# EAGLE schematic Main (EAGLE 6.0)
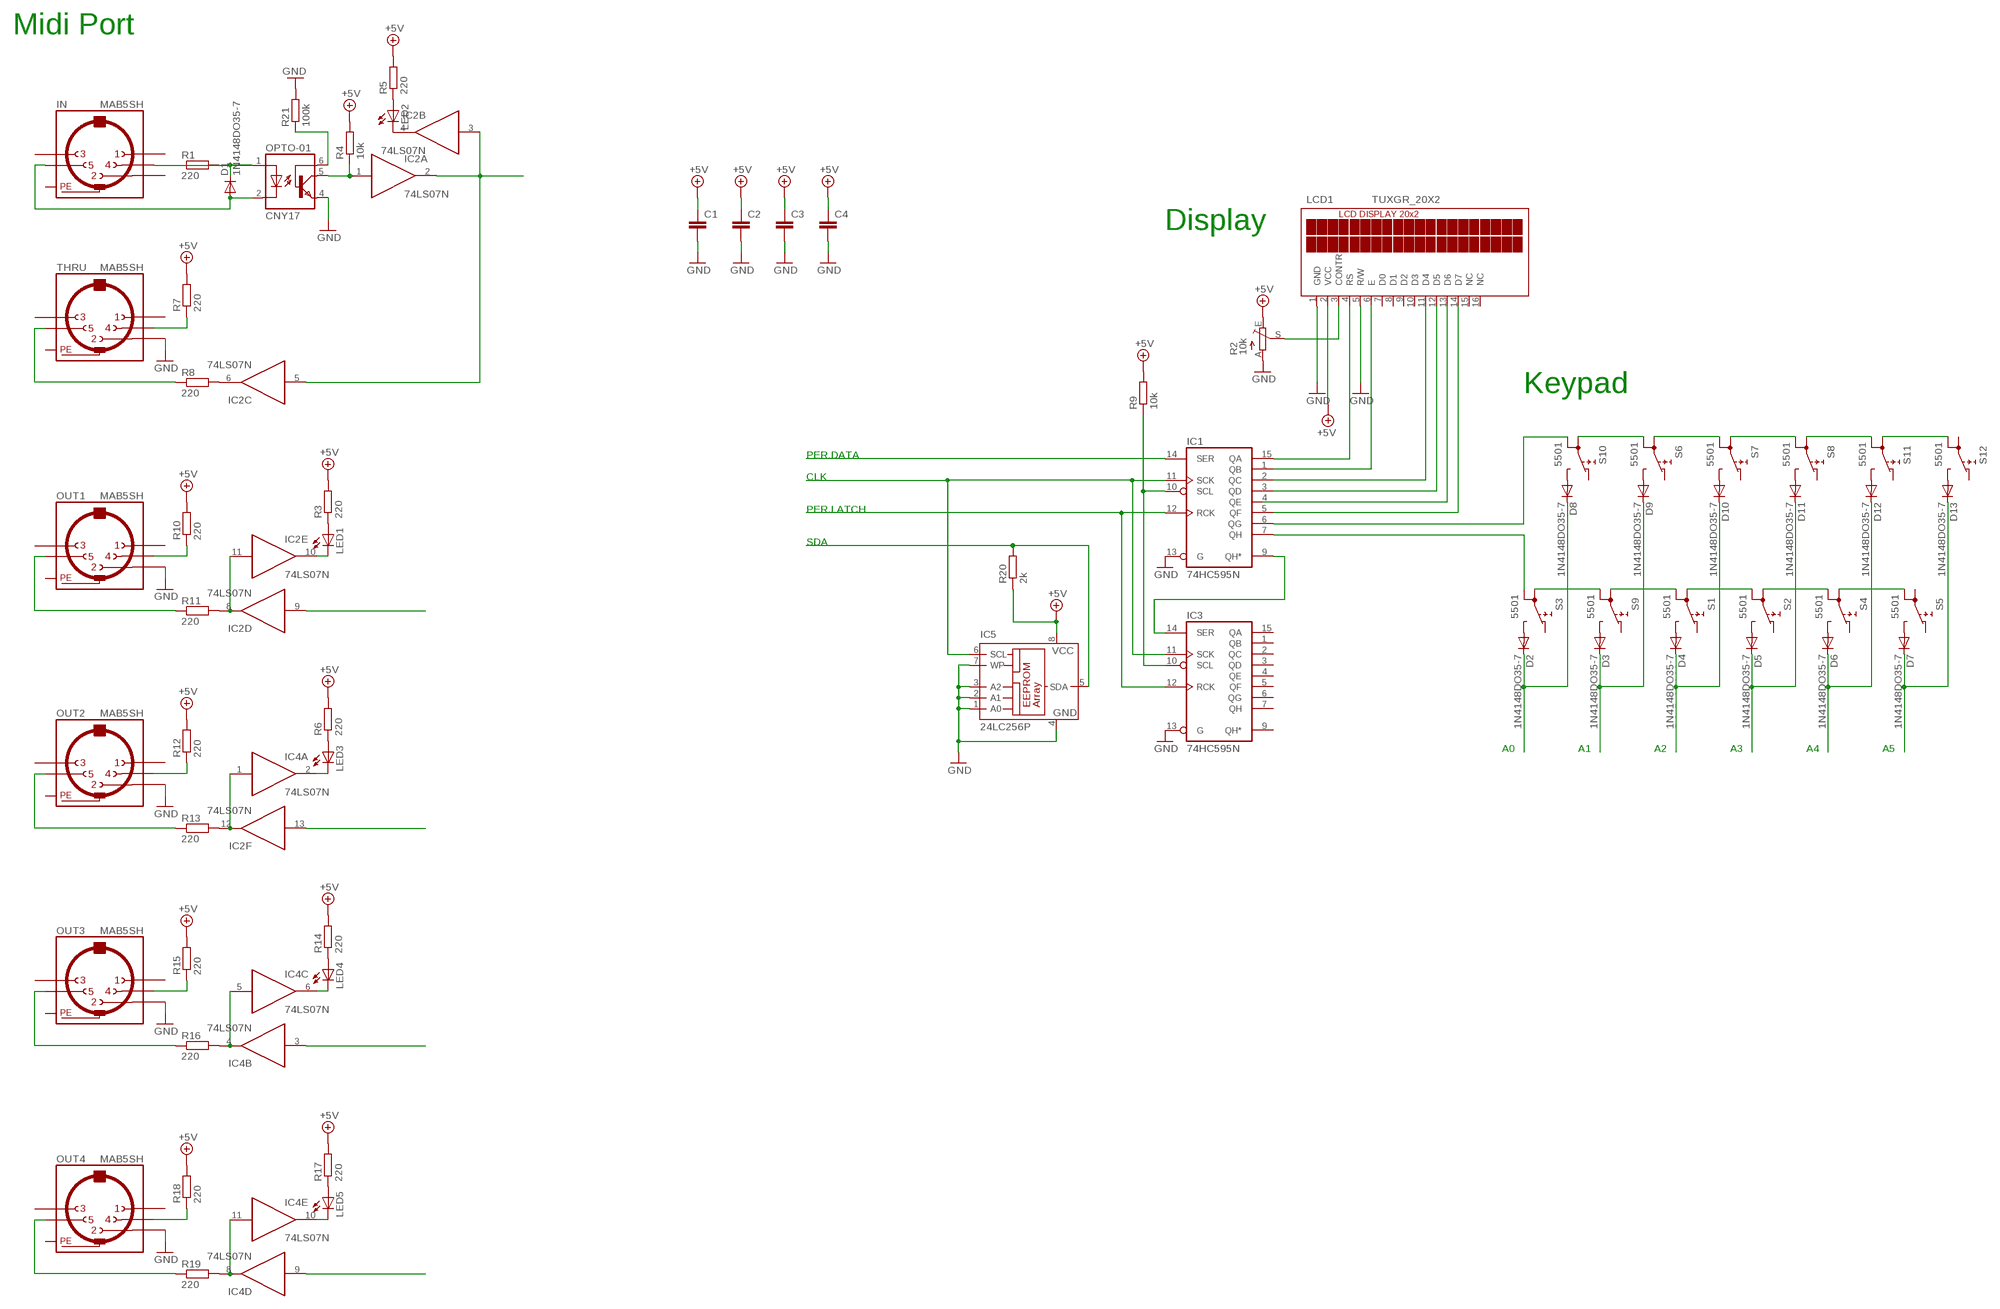
[diagram p0: schematic, sheet 1]

## Parts
C1  C-EU025-024X044  [C025-024X044]
C2  C-EU025-024X044  [C025-024X044]
C3  C-EU025-024X044  [C025-024X044]
C4  C-EU025-024X044  [C025-024X044]
D1  1N4148DO35-7  [DO35-7]
D2  1N4148DO35-7  [DO35-7]
D3  1N4148DO35-7  [DO35-7]
D4  1N4148DO35-7  [DO35-7]
D5  1N4148DO35-7  [DO35-7]
D6  1N4148DO35-7  [DO35-7]
D7  1N4148DO35-7  [DO35-7]
D8  1N4148DO35-7  [DO35-7]
D9  1N4148DO35-7  [DO35-7]
D10  1N4148DO35-7  [DO35-7]
D11  1N4148DO35-7  [DO35-7]
D12  1N4148DO35-7  [DO35-7]
D13  1N4148DO35-7  [DO35-7]
IC1  74HC595N  [DIL16]
IC2  74LS07N  [DIL14]
IC3  74HC595N  [DIL16]
IC4  74LS07N  [DIL14]
IC5  24LC256P  [DIL8]
IN  MAB5SH  [MAB5SH]
LCD1  TUXGR_20X2  [TUXGR_20X2]
LED1  LED3MM  [LED3MM]
LED2  LED3MM  [LED3MM]
LED3  LED3MM  [LED3MM]
LED4  LED3MM  [LED3MM]
LED5  LED3MM  [LED3MM]
OPTO-01  CNY17  [DIL06]
OUT1  MAB5SH  [MAB5SH]
OUT2  MAB5SH  [MAB5SH]
OUT3  MAB5SH  [MAB5SH]
OUT4  MAB5SH  [MAB5SH]
R1  220  R-EU_0207/10  [0207/10]
R2  10k  TRIM_EU-B25P  [B25P]
R3  220  R-EU_0207/10  [0207/10]
R4  10k  R-EU_0207/10  [0207/10]
R5  220  R-EU_0207/10  [0207/10]
R6  220  R-EU_0207/10  [0207/10]
R7  220  R-EU_0207/10  [0207/10]
R8  220  R-EU_0207/10  [0207/10]
R9  10k  R-EU_0207/10  [0207/10]
R10  220  R-EU_0207/10  [0207/10]
R11  220  R-EU_0207/10  [0207/10]
R12  220  R-EU_0207/10  [0207/10]
R13  220  R-EU_0207/10  [0207/10]
R14  220  R-EU_0207/10  [0207/10]
R15  220  R-EU_0207/10  [0207/10]
R16  220  R-EU_0207/10  [0207/10]
R17  220  R-EU_0207/10  [0207/10]
R18  220  R-EU_0207/10  [0207/10]
R19  220  R-EU_0207/10  [0207/10]
R20  2k  R-EU_0207/10  [0207/10]
R21  100k  R-EU_0207/10  [0207/10]
S1  5501  [5501]
S2  5501  [5501]
S3  5501  [5501]
S4  5501  [5501]
S5  5501  [5501]
S6  5501  [5501]
S7  5501  [5501]
S8  5501  [5501]
S9  5501  [5501]
S10  5501  [5501]
S11  5501  [5501]
S12  5501  [5501]
THRU  MAB5SH  [MAB5SH]

## Nets
+5V: C1.1 C2.1 C3.1 C4.1 IC5.8(VCC) LCD1.2(VCC) R2.E R3.2 R4.2 R5.2 R6.2 R7.2 R9.2 R10.2 R12.2 R14.2 R15.2 R17.2 R18.2 R20.1
GND: C1.2 C2.2 C3.2 C4.2 IC1.13(G) IC3.13(G) IC5.1(A0) IC5.2(A1) IC5.3(A2) IC5.4(GND) IC5.7(WP) LCD1.1(GND) LCD1.5(R/W) OPTO-01.4(EMI) OUT1.2 OUT2.2 OUT3.2 OUT4.2 R2.A R21.2 THRU.2
N$1: D1.C IN.4 OPTO-01.1(A) R1.1 R1.2
N$2: D1.A IN.5 OPTO-01.2(C)
N$3: IC2.1(A:I) OPTO-01.5(COL) R4.1
N$4: LED2.A R5.1
N$5: IC2.4(B:O) LED2.K(C)
N$6: LED3.A R6.1
N$7: IC2.6(C:O) R8.2
N$8: IC4.2(A:O) LED3.K(C)
N$9: IC2.8(D:O) R11.2
N$10: R8.1 THRU.5
N$11: R7.1 THRU.4
N$12: IC4.1(A:I)
N$13: IC1.5(QF) LCD1.14(D7)
N$14: LCD1.13(D6)
N$15: IC1.3(QD) LCD1.12(D5)
N$16: IC1.2(QC) LCD1.11(D4)
N$17: IC1.1(QB) LCD1.6(E)
N$18: IC1.15(QA) LCD1.4(RS)
N$19: IC1.10(SCL) IC3.10(SCL) R9.1
N$20: LCD1.3(CONTR) R2.S
N$21: IC1.14(SER)
N$22: IC1.11(SCK) IC3.11(SCK) IC5.6(SCL)
N$23: IC1.9(QH*) IC3.14(SER)
N$24: IC1.12(RCK) IC3.12(RCK)
N$25: LED1.A R3.1
N$26: IC2.10(E:O) LED1.K(C)
N$27: IC2.12(F:O) R13.2
N$28: IC2.11(E:I)
N$29: OUT1.5 R11.1
N$30: OUT1.4 R10.1
N$31: IC2.9(D:I)
N$32: OUT2.5 R13.1
N$33: OUT2.4 R12.1
N$34: IC2.2(A:O) IC2.3(B:I) IC2.5(C:I)
N$35: IC2.13(F:I)
N$36: LED4.A R14.1
N$37: IC4.6(C:O) LED4.K(C)
N$38: IC4.4(B:O) R16.2
N$39: IC4.5(C:I)
N$40: OUT3.5 R16.1
N$41: OUT3.4 R15.1
N$42: IC4.3(B:I)
N$43: LED5.A R17.1
N$44: IC4.10(E:O) LED5.K(C)
N$45: IC4.8(D:O) R19.2
N$46: IC4.11(E:I)
N$47: OUT4.5 R19.1
N$48: OUT4.4 R18.1
N$49: IC4.9(D:I)
N$50: S4.1A S5.1B
N$51: S2.1A S4.1B
N$52: S1.1A S2.1B
N$53: S1.1B S9.1A
N$54: S3.1A S9.1B
N$55: D2.A S3.NO
N$56: D3.A S9.NO
N$57: D4.A S1.NO
N$58: D5.A S2.NO
N$59: D6.A S4.NO
N$60: D7.A S5.NO
N$61: S11.1A S12.1B
N$62: S8.1A S11.1B
N$63: S7.1A S8.1B
N$64: S6.1A S7.1B
N$65: S6.1B S10.1A
N$66: D8.A S10.NO
N$67: D9.A S6.NO
N$68: D10.A S7.NO
N$69: D11.A S8.NO
N$70: D12.A S11.NO
N$71: D13.A S12.NO
N$72: IC1.6(QG) S10.1B
N$73: IC1.7(QH) S3.1B
N$74: D2.C D8.C
N$75: IC5.5(SDA) R20.2
N$76: D3.C D9.C
N$77: D4.C D10.C
N$78: D5.C D11.C
N$79: D6.C D12.C
N$80: D7.C D13.C
N$81: OPTO-01.6(BAS) R21.1
Unconnected: IC1.4(QE) IC3.1(QB) IC3.2(QC) IC3.3(QD) IC3.4(QE) IC3.5(QF) IC3.6(QG) IC3.7(QH) IC3.9(QH*) IC3.15(QA) IC4.12(F:O) IC4.13(F:I) IN.1 IN.2 IN.3 LCD1.7(D0) LCD1.8(D1) LCD1.9(D2) LCD1.10(D3) LCD1.15(NC) LCD1.16(NC) OUT1.1 OUT1.3 OUT2.1 OUT2.3 OUT3.1 OUT3.3 OUT4.1 OUT4.3 S1.NC S2.NC S3.NC S4.NC S5.1A S5.NC S6.NC S7.NC S8.NC S9.NC S10.NC S11.NC S12.1A S12.NC THRU.1 THRU.3

## Notes on the sheet
- Midi Port
- Display
- Keypad
- PER.DATA
- CLK
- PER.LATCH
- SDA
- A0 | A1 | A2 | A3 | A4 | A5

## Power pins joined to a net without a drawn wire
GND: IC1.8(GND) IC2.7(P:GND) IC3.8(GND) IC4.7(P:GND)
PE: IN.PE IN.PE@(PE) OUT1.PE OUT1.PE@(PE) OUT2.PE OUT2.PE@(PE) OUT3.PE OUT3.PE@(PE) OUT4.PE OUT4.PE@(PE) THRU.PE THRU.PE@(PE)
VCC: IC1.16(VCC) IC2.14(P:VCC) IC3.16(VCC) IC4.14(P:VCC)

## Library data of the parts
C1-C4 = resistor:C-EU: CAPACITOR, European symbol
D1-D13 = diode:1N4148: DIODE high speed (Philips)
IC1 IC3 = 74xx-eu:74*595: 8-bit SHIFT REGISTER, output latch
IC2 IC4 = 74xx-eu:74*07: Hex BUFFER, open collector high-voltage output
IC5 = microchip:24*: Serial EEPROM I2C; MF: MICROCHIP; MPN: 24LC256-E/P; OC_FARNELL: 9757970; OC_NEWARK: 92C7169
IN OUT1-OUT4 THRU = con-hirschmann:MAB5SH: Female CONNECTOR 5 pins 90 deg. with shield, horizontal (DIN 41524); OC_FARNELL: 809883; OC_NEWARK: unknown
LCD1 = display-lcd:TUXGR_20X2: Tuxgraphics LCD display 20x2 characters reflective, without background light Source: tuxgr_20x2.pdf; OC_FARNELL: unknown; OC_NEWARK: unknown
LED1-LED5 = led:LED: LED OSRAM: - CHIPLED LG R971, LG N971, LY N971, LG Q971, LY Q971, LO R971, LY R971 LH N974, LH R974 LS Q976, LO Q976, LY Q976 LO Q996 - Hyper CHIPLED LW Q18S LB Q993, LB Q99A, LB R99A - SideLED LS A670, LO A670, LY A670, LG A670, LP A670 LB A673, LV A673, LT A673, LW A673 LH A674 LY A675 LS A676, LA A676, LO A676, LY A676, LW A676 LS A679, LY A679, LG A679 - Hyper Micro SIDELED® LS Y876, LA Y876, LO Y876, LY Y876 LT Y87S - SmartLED LW L88C, LW L88S LB L89C, LB L89S, LG L890 LS L89K, LO L89K, LY L89K LS L896, LA L896, LO L896, LY L896 - TOPLED LS T670, LO T670, LY T670, LG T670, LP T670 LSG T670, LSP T670, LSY T670, LOP T670, LYG T670 LG T671, LOG T671, LSG T671 LB T673, LV T673, LT T673, LW T673 LH T674 LS T676, LA T676, LO T676, LY T676, LB T676, LH T676, LSB T676, LW T676 LB T67C, LV T67C, LT T67C, LS T67K, LO T67K, LY T67K, LW E67C LS E67B, LA E67B, LO E67B, LY E67B, LB E67C, LV E67C, LT E67C LW T67C LS T679, LY T679, LG T679 LS T770, LO T770, LY T770, LG T770, LP T770 LB T773, LV T773, LT T773, LW T773 LH T774 LS E675, LA E675, LY E675, LS T675 LS T776, LA T776, LO T776, LY T776, LB T776 LHGB T686 LT T68C, LB T68C - Hyper Mini TOPLED® LB M676 - Mini TOPLED Santana® LG M470 LS M47K, LO M47K, LY M47K Source: http://www.osram.convergy.de LUXEON: - LUMILED® LXK2-PW12-R00, LXK2-PW12-S00, LXK2-PW14-U00, LXK2-PW14-V00 LXK2-PM12-R00, LXK2-PM12-S00, LXK2-PM14-U00 LXK2-PE12-Q00, LXK2-PE12-R00, LXK2-PE12-S00, LXK2-PE14-T00, LXK2-PE14-U00 LXK2-PB12-K00, LXK2-PB12-L00, LXK2-PB12-M00, LXK2-PB14-N00, LXK2-PB14-P00, LXK2-PB14-Q00 LXK2-PR12-L00, LXK2-PR12-M00, LXK2-PR14-Q00, LXK2-PR14-R00 LXK2-PD12-Q00, LXK2-PD12-R00, LXK2-PD12-S00 LXK2-PH12-R00, LXK2-PH12-S00 LXK2-PL12-P00, LXK2-PL12-Q00, LXK2-PL12-R00 Source: www.luxeon.com KINGBRIGHT: KA-3528ASYC Source: www.kingbright.com
OPTO-01 = optocoupler:CNY17: SIEMENS OPTO COUPLER; MPN: CNY17-1; OC_FARNELL: 1045399; OC_NEWARK: 05M4044
R1 R3-R21 = resistor:R-EU_: RESISTOR, European symbol
R2 = pot:TRIM_EU-: POTENTIOMETER
S1-S12 = switch:55?: PUSHBUTTON SERIES 5500 SWITCHES Source: www.e-switch.com .. 5500.pdf